# EAGLE design rapidshark-dart-detector-backlight-mk-1.0 (EAGLE 6.5.0)
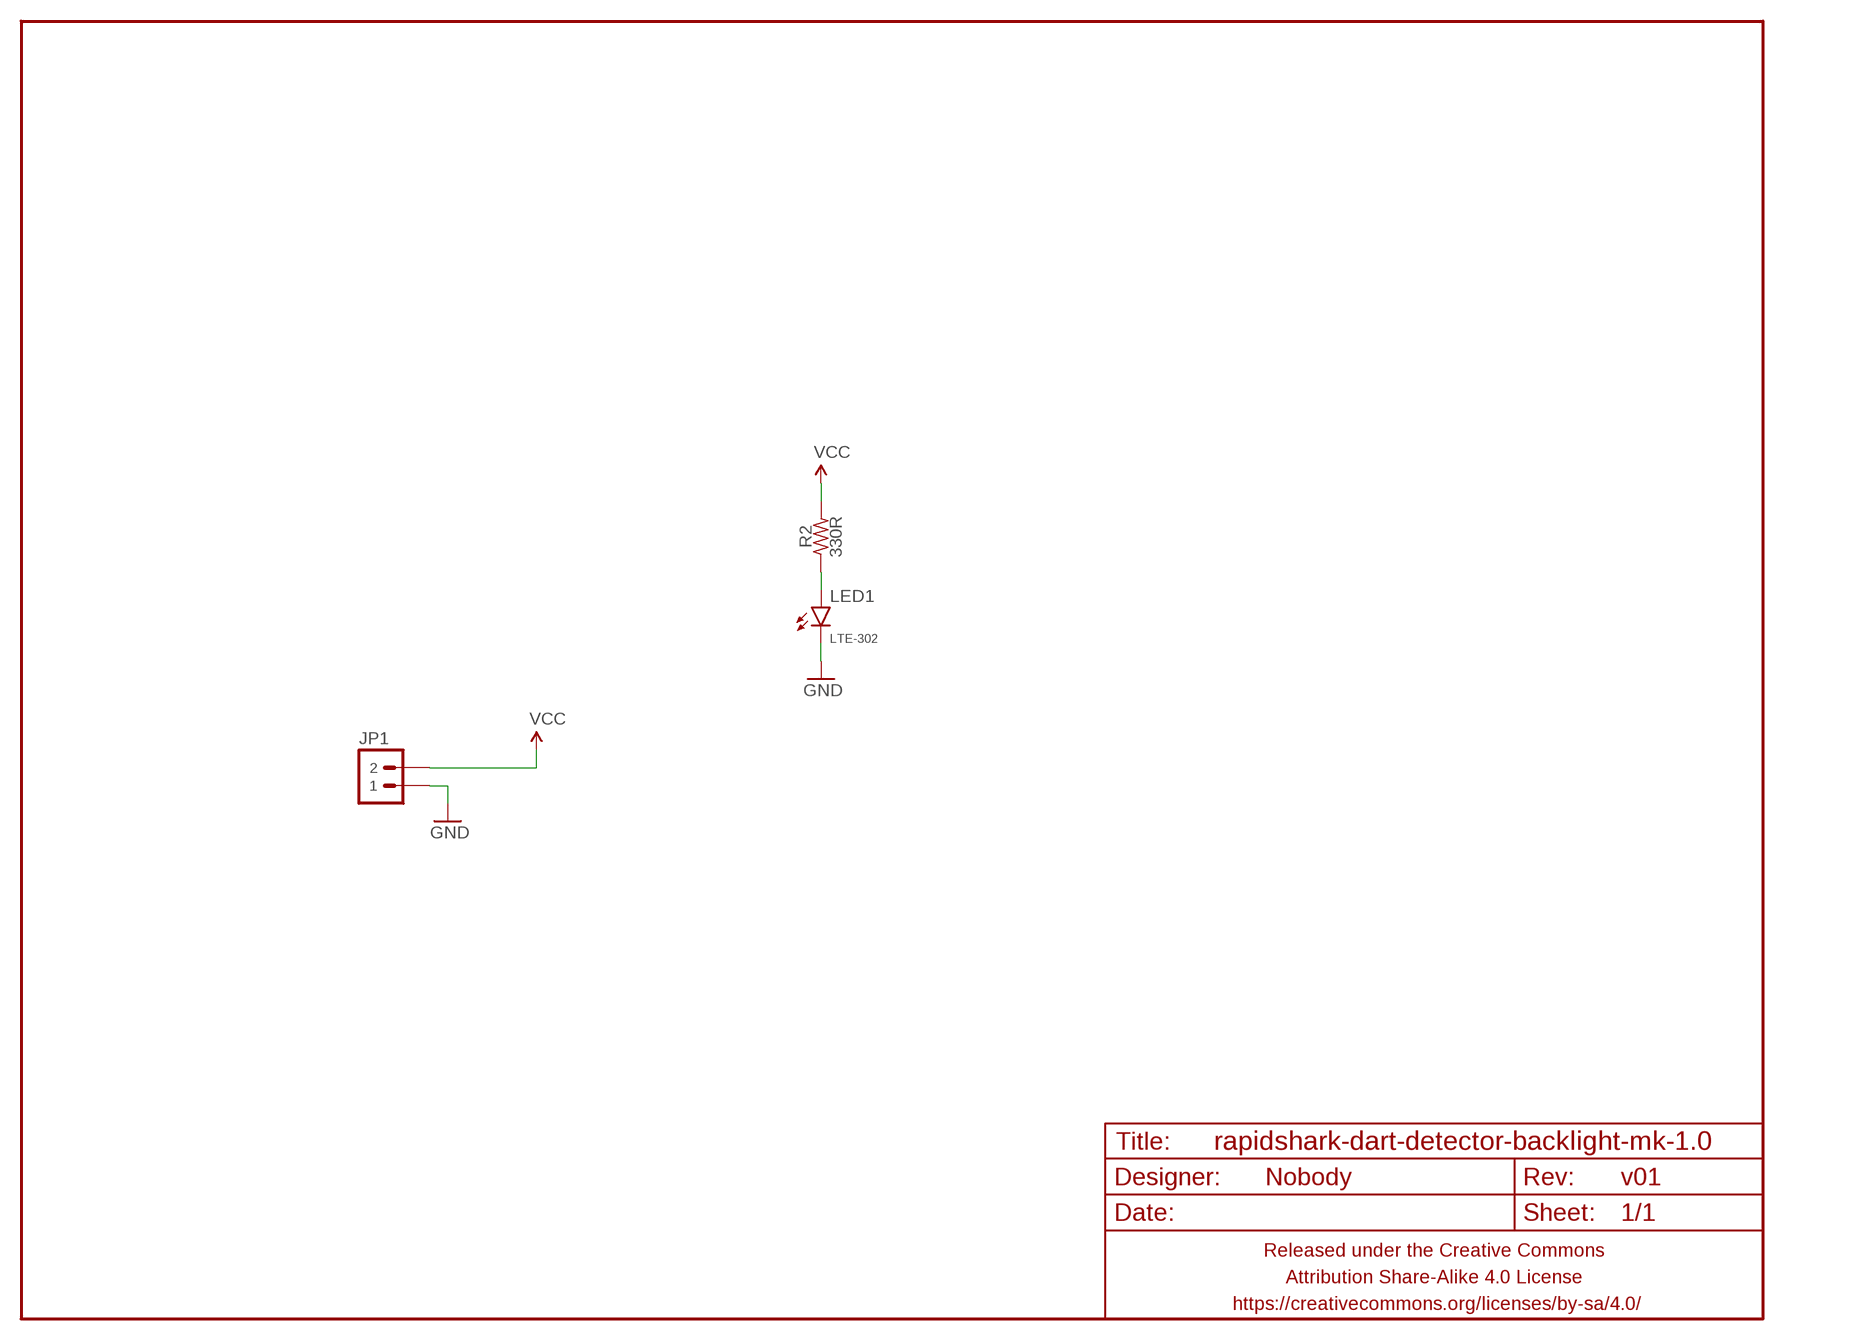
[diagram p0: schematic, sheet 1]

## Parts
FRAME1  FRAME-LETTERNO_PACKAGE  [DUMMY]
JP1  M02JST-PTH-RA-R+  [JST-2-PH-RA-PTH-R+]
LED1  LTE-302  LED-VALUEIR-LED-SIDE  [LED-2.54MM-SIDE]
R2  330R  RESISTORPTH-AXIAL-7.62MM  [RESISTOR-AXIAL-PTH-7.62MM]

## Nets
GND: JP1.1 LED1.K(C)
N$2: LED1.A R2.P$1
VCC: JP1.2 R2.P$2

## Library data of the parts
FRAME1 = A_butts:FRAME-LETTER: Schematic Frame Standard 8.5x11 US Letter frame; DESIGNER: Nobody; VERSION: v01
JP1 = A_butts:M02: Standard 2-pin 0.1" header. Use with - straight break away headers ( PRT-00116) - right angle break away headers (PRT-00553) - swiss pins (PRT-00743) - machine pins (PRT-00117) - female headers (PRT-00115) Molex polarized connector foot print use with: PRT-08233 with associated crimp pins and housings. 2.54_SCREWTERM for use with PRT-10571. 3.5mm Screw Terminal footprints for PRT-08084 5mm Screw Terminal footprints for use with PRT-08433
LED1 = A_butts:LED-VALUE
R2 = A_butts:RESISTOR: RESISTOR, American symbol

## Board
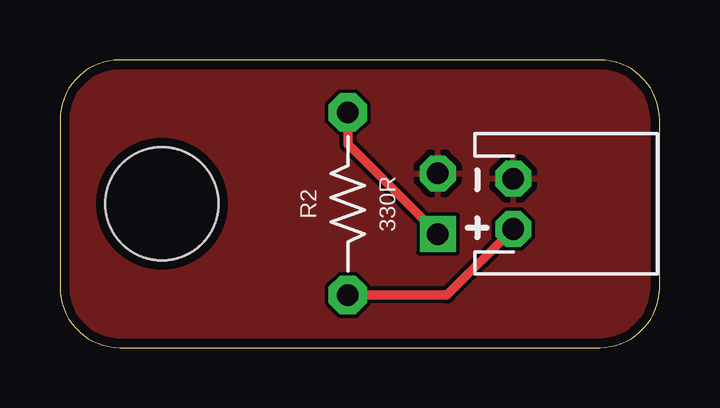
[diagram p1: board, top side]
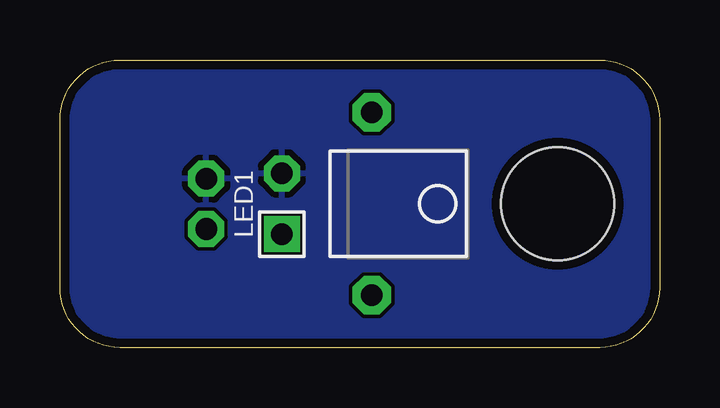
[diagram p2: board, bottom side, seen from below]

Size 25 x 12 mm. Coordinates in mm from the lower left corner, seen from the top.
Outline: 0,9.5 0,2.5 arc90 2.5,0 22.5,0 arc90 25,2.5 25,9.5 arc90 22.5,12 2.5,12 arc90 0,9.5
Copper layers (1*16): Top 0.0356mm / dielectric 1.5011mm / Bottom 0.0356mm
Design rules "LaenPCBOrder_2": minimum track width 6mil, minimum drill 13mil, track to track 6mil, track to pad 6mil, pad to pad 6mil, via to via 6mil, smd to smd 6mil, copper to edge 15mil, drill to drill 6mil, minimum pad ring 7mil, minimum via ring 7mil, stop-mask expansion 3mil, vias tented up to drill 20mil, thermal gap 10mil
Holes 4.7 mm at 4.25,6

### Footprints (pad centres in the part's own frame; a part is rotated, then mirrored left to right if it is on the bottom)
JST-2-PH-RA-PTH-R+ = drill 0.9 pad 1.5 octagon: 1 -1.05,0; 2 1.05,0
LED-2.54MM-SIDE = drill 0.9 pad 1.5 square: A 1.27,0 | drill 0.9 pad 1.5 octagon: K -1.27,0
RESISTOR-AXIAL-PTH-7.62MM = drill 0.9 pad 1.6 octagon: P$1 -3.81,0; P$2 3.81,0

### Placement (x,y rotation side)
FRAME1  0,0 0 top
JP1  18.9,6 270 top
LED1  15.75,6 270 bottom
R2  12,6 270 top

### Tracks (layer width: path | path; a pad name or v marks a point on that pad's centre or on a via)
GND
  pour Bottom (rank 5): 0,0 0,12 25,12 25,0
  pour Top (rank 5): 0,0 0,12 25,12 25,0
N$2
  Top 0.4: LED1.A 12,8.48 R2.P$1
VCC
  Top 0.4: JP1.2 16.14,2.19 R2.P$2